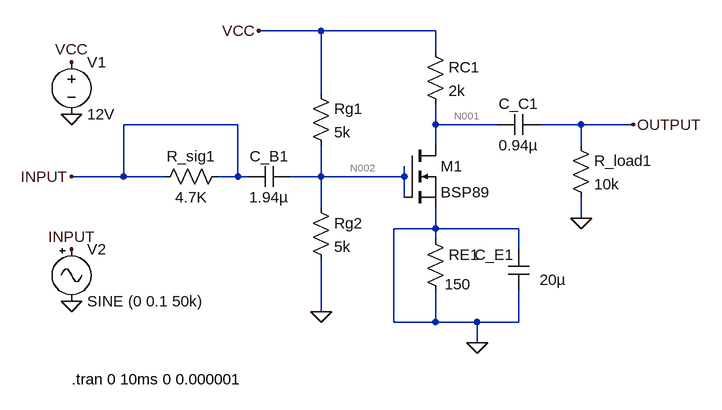
[diagram p0: schematic classicMOSFETinSPICE.asc]
* classicMOSFETinSPICE.asc
Rg2 N002 0 5k
Rg1 VCC N002 5k
RC1 VCC N001 2k
RE1 0 0 150
R_load1 OUTPUT 0 10k
R_sig1 INPUT INPUT 4.7K
C_B1 N002 INPUT 1.94µ
C_C1 OUTPUT N001 0.94µ
C_E1 0 0 20µ
V1 VCC 0 12V
V2 INPUT 0 SINE (0 0.1 50k)
M1 N001 N002 0 0 BSP89
.model NMOS NMOS
.model PMOS PMOS
.lib standard.mos
.tran 0 10ms 0 0.000001
.backanno
.end

* Results of the author's LTspice run, read from the files saved beside the schematic
* Operating Point, zero values left out:
*   V(n002) = 6 V
*   V(vcc) = 12 V
*   V(n001) = 24.3 mV
*   Id(M1) = 5.988 mA
*   Is(M1) = -5.988 mA
*   I(Rg2) = 1.2 mA
*   I(Rg1) = 1.2 mA
*   I(Rc1) = 5.988 mA
*   I(V1) = -7.188 mA
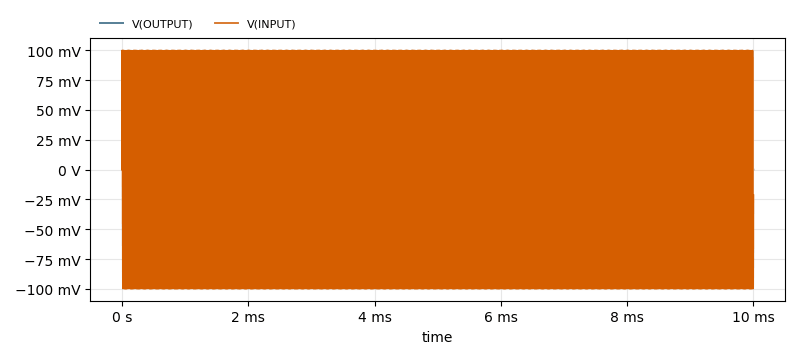
[diagram p1: Transient Analysis of classicMOSFETinSPICE.asc, plotted from the saved traces]
* Transient Analysis, 1 run:
*   V(OUTPUT): min -40.44 µV, max 41.46 µV, average 267.5 nV, rms 29.03 µV, last 21.78 µV
*   V(INPUT): min -100 mV, max 100 mV, average 11.01 nV, rms 70.92 mV, last 0 V